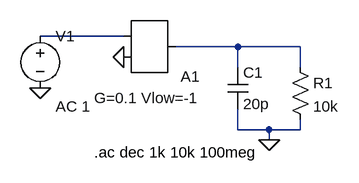
[diagram p0: schematic EJE10.asc]
EJE10.asc, the LTspice schematic file:
Version 4
SHEET 1 880 680
WIRE 16 96 -112 96
WIRE 192 112 96 112
WIRE 288 112 192 112
WIRE 192 144 192 112
WIRE 288 144 288 112
WIRE 192 240 192 208
WIRE 240 240 192 240
WIRE 288 240 288 224
WIRE 288 240 240 240
WIRE 240 256 240 240
FLAG 240 256 0
FLAG -112 176 0
FLAG 16 128 0
SYMBOL cap 176 144 R0
SYMATTR InstName C1
SYMATTR Value 20p
SYMBOL res 272 128 R0
SYMATTR InstName R1
SYMATTR Value 10k
SYMBOL SpecialFunctions\\ota 48 176 M180
WINDOW 3 -77 -15 Left 2
SYMATTR InstName A1
SYMATTR Value G=0.1 Vlow=-1
SYMBOL voltage -112 80 R0
WINDOW 123 24 124 Left 2
WINDOW 39 0 0 Left 0
SYMATTR InstName V1
SYMATTR Value ""
SYMATTR Value2 AC 1
TEXT -29 275 Left 2 !.ac dec 1k 10k 100meg

The netlist it stands for:
* EJE10.asc
C1 N002 0 20p
R1 N002 0 10k
A1 0 N001 0 0 0 0 N002 0 OTA G=0.1 Vlow=-1
V1 N001 0 AC 1
.ac dec 1k 10k 100meg
.backanno
.end